# EAGLE board Promobot revA (EAGLE 6.5.0), part 1 of 3
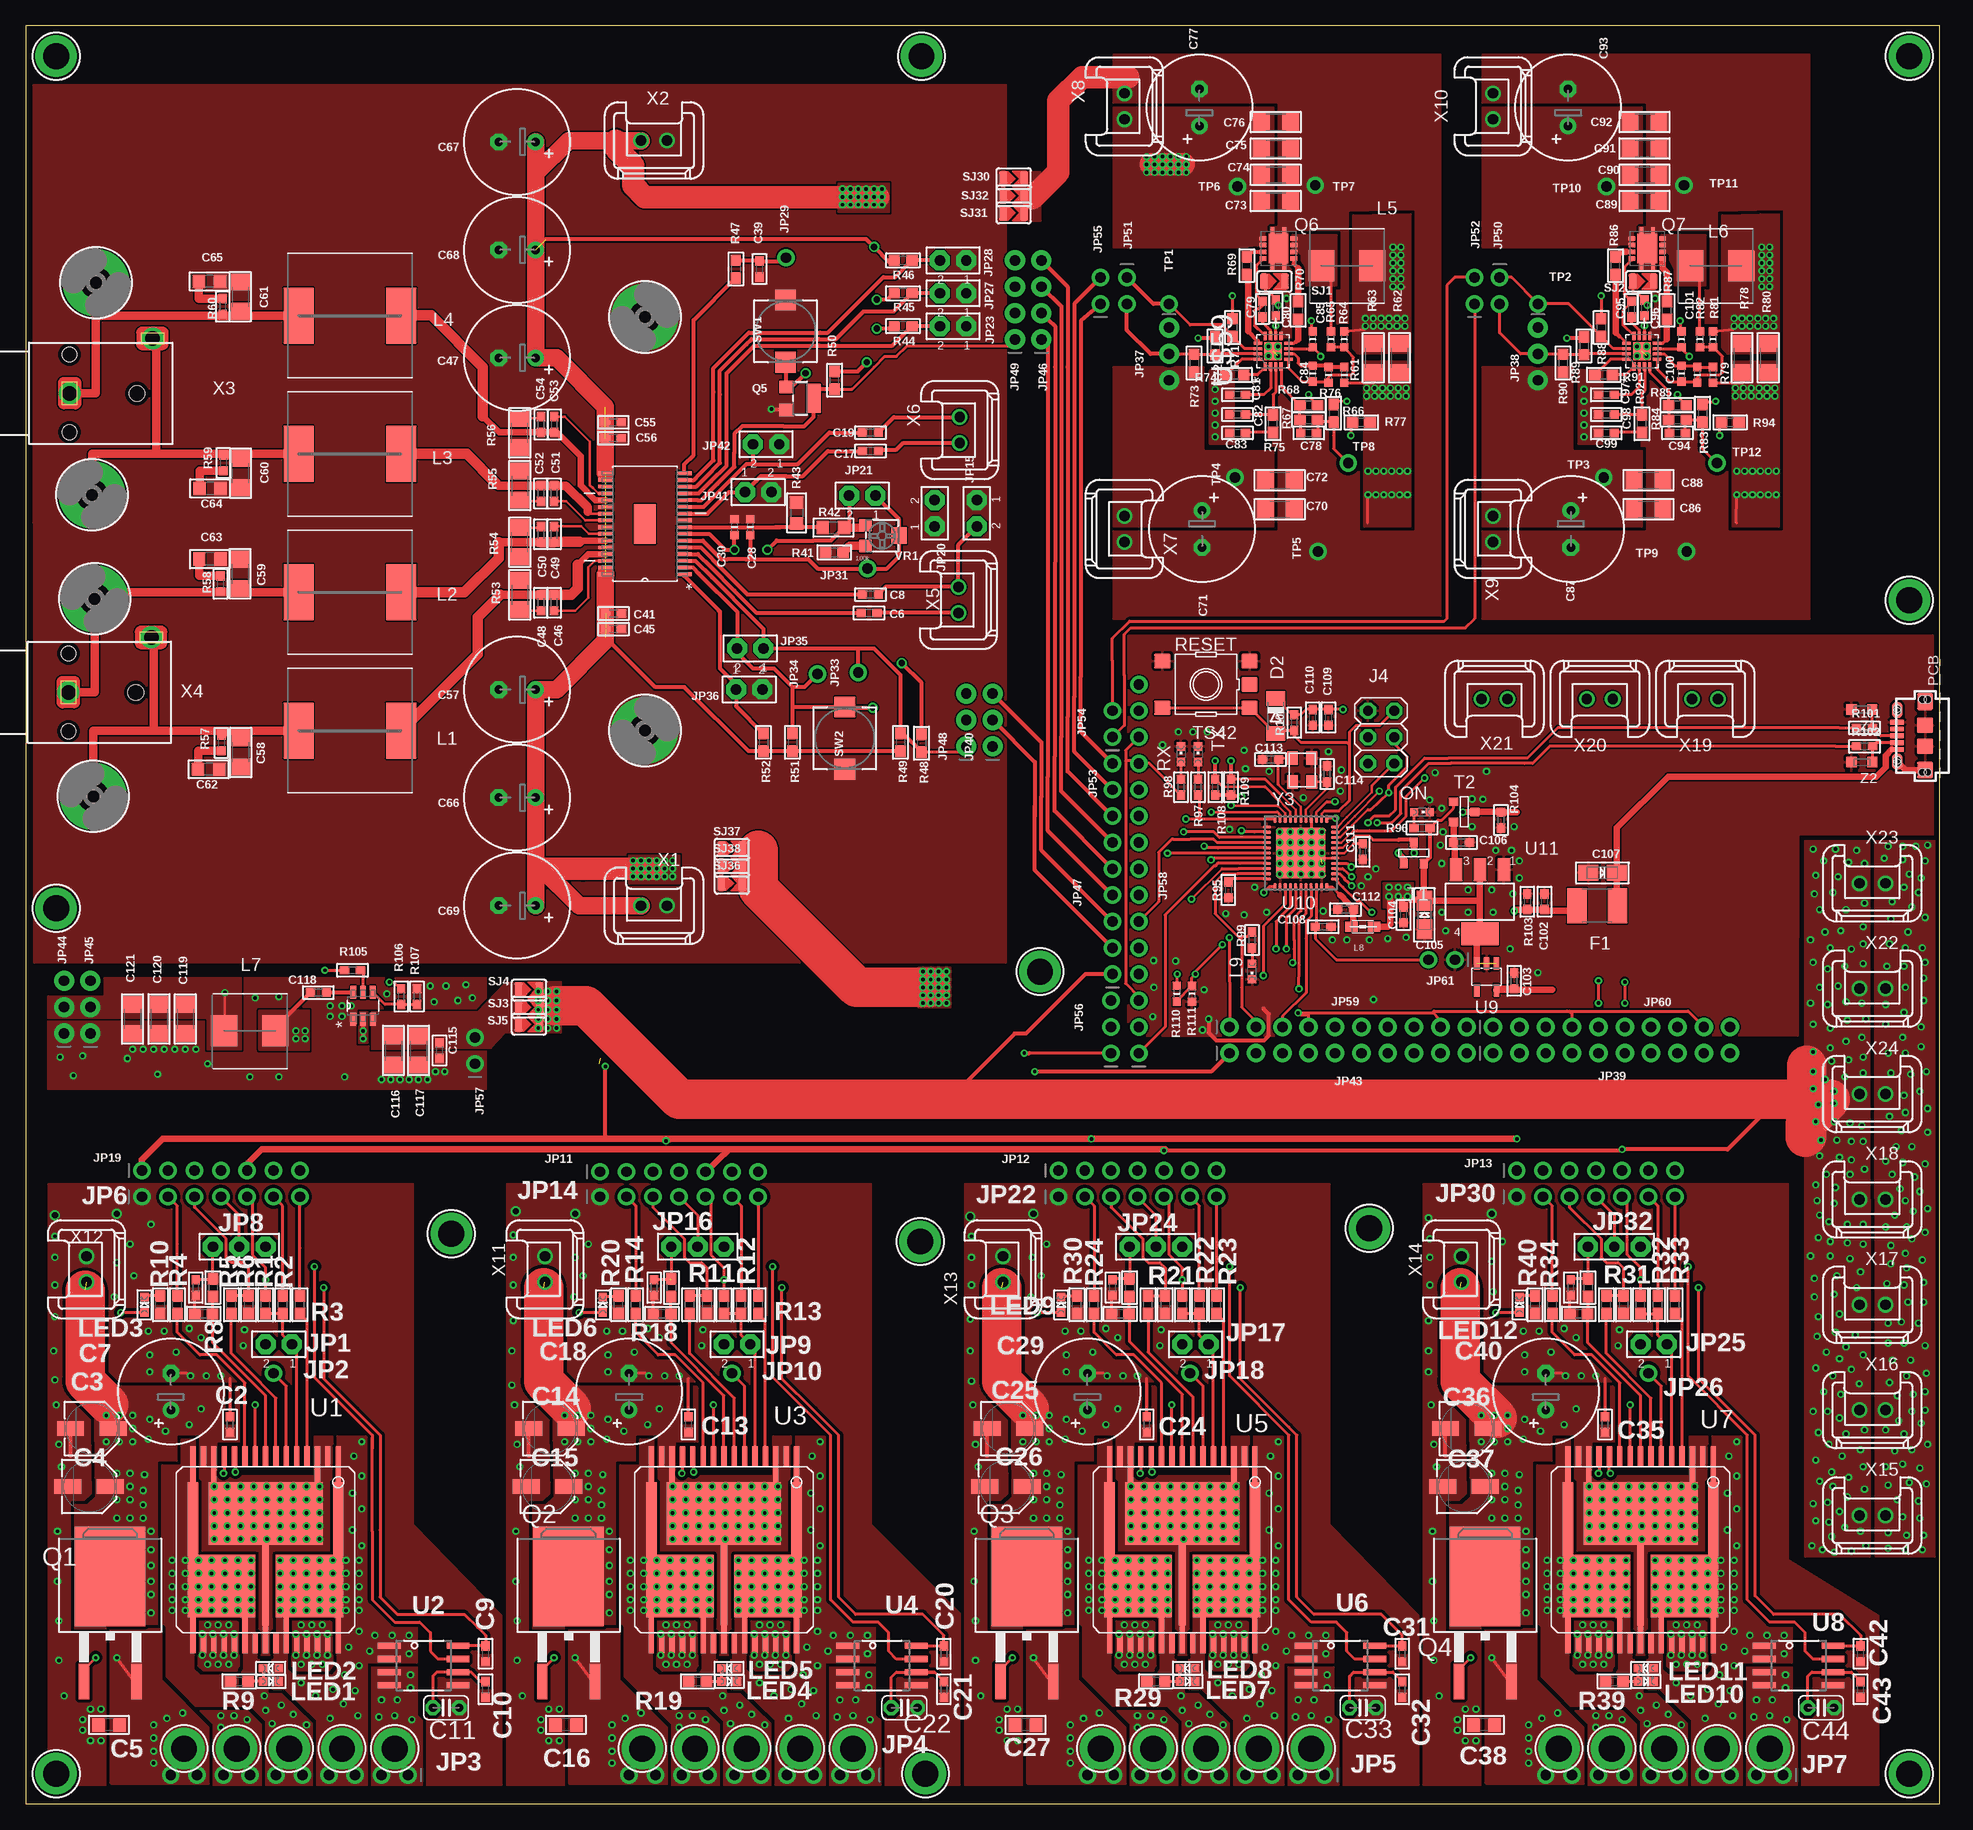
[diagram p10: board, top side]
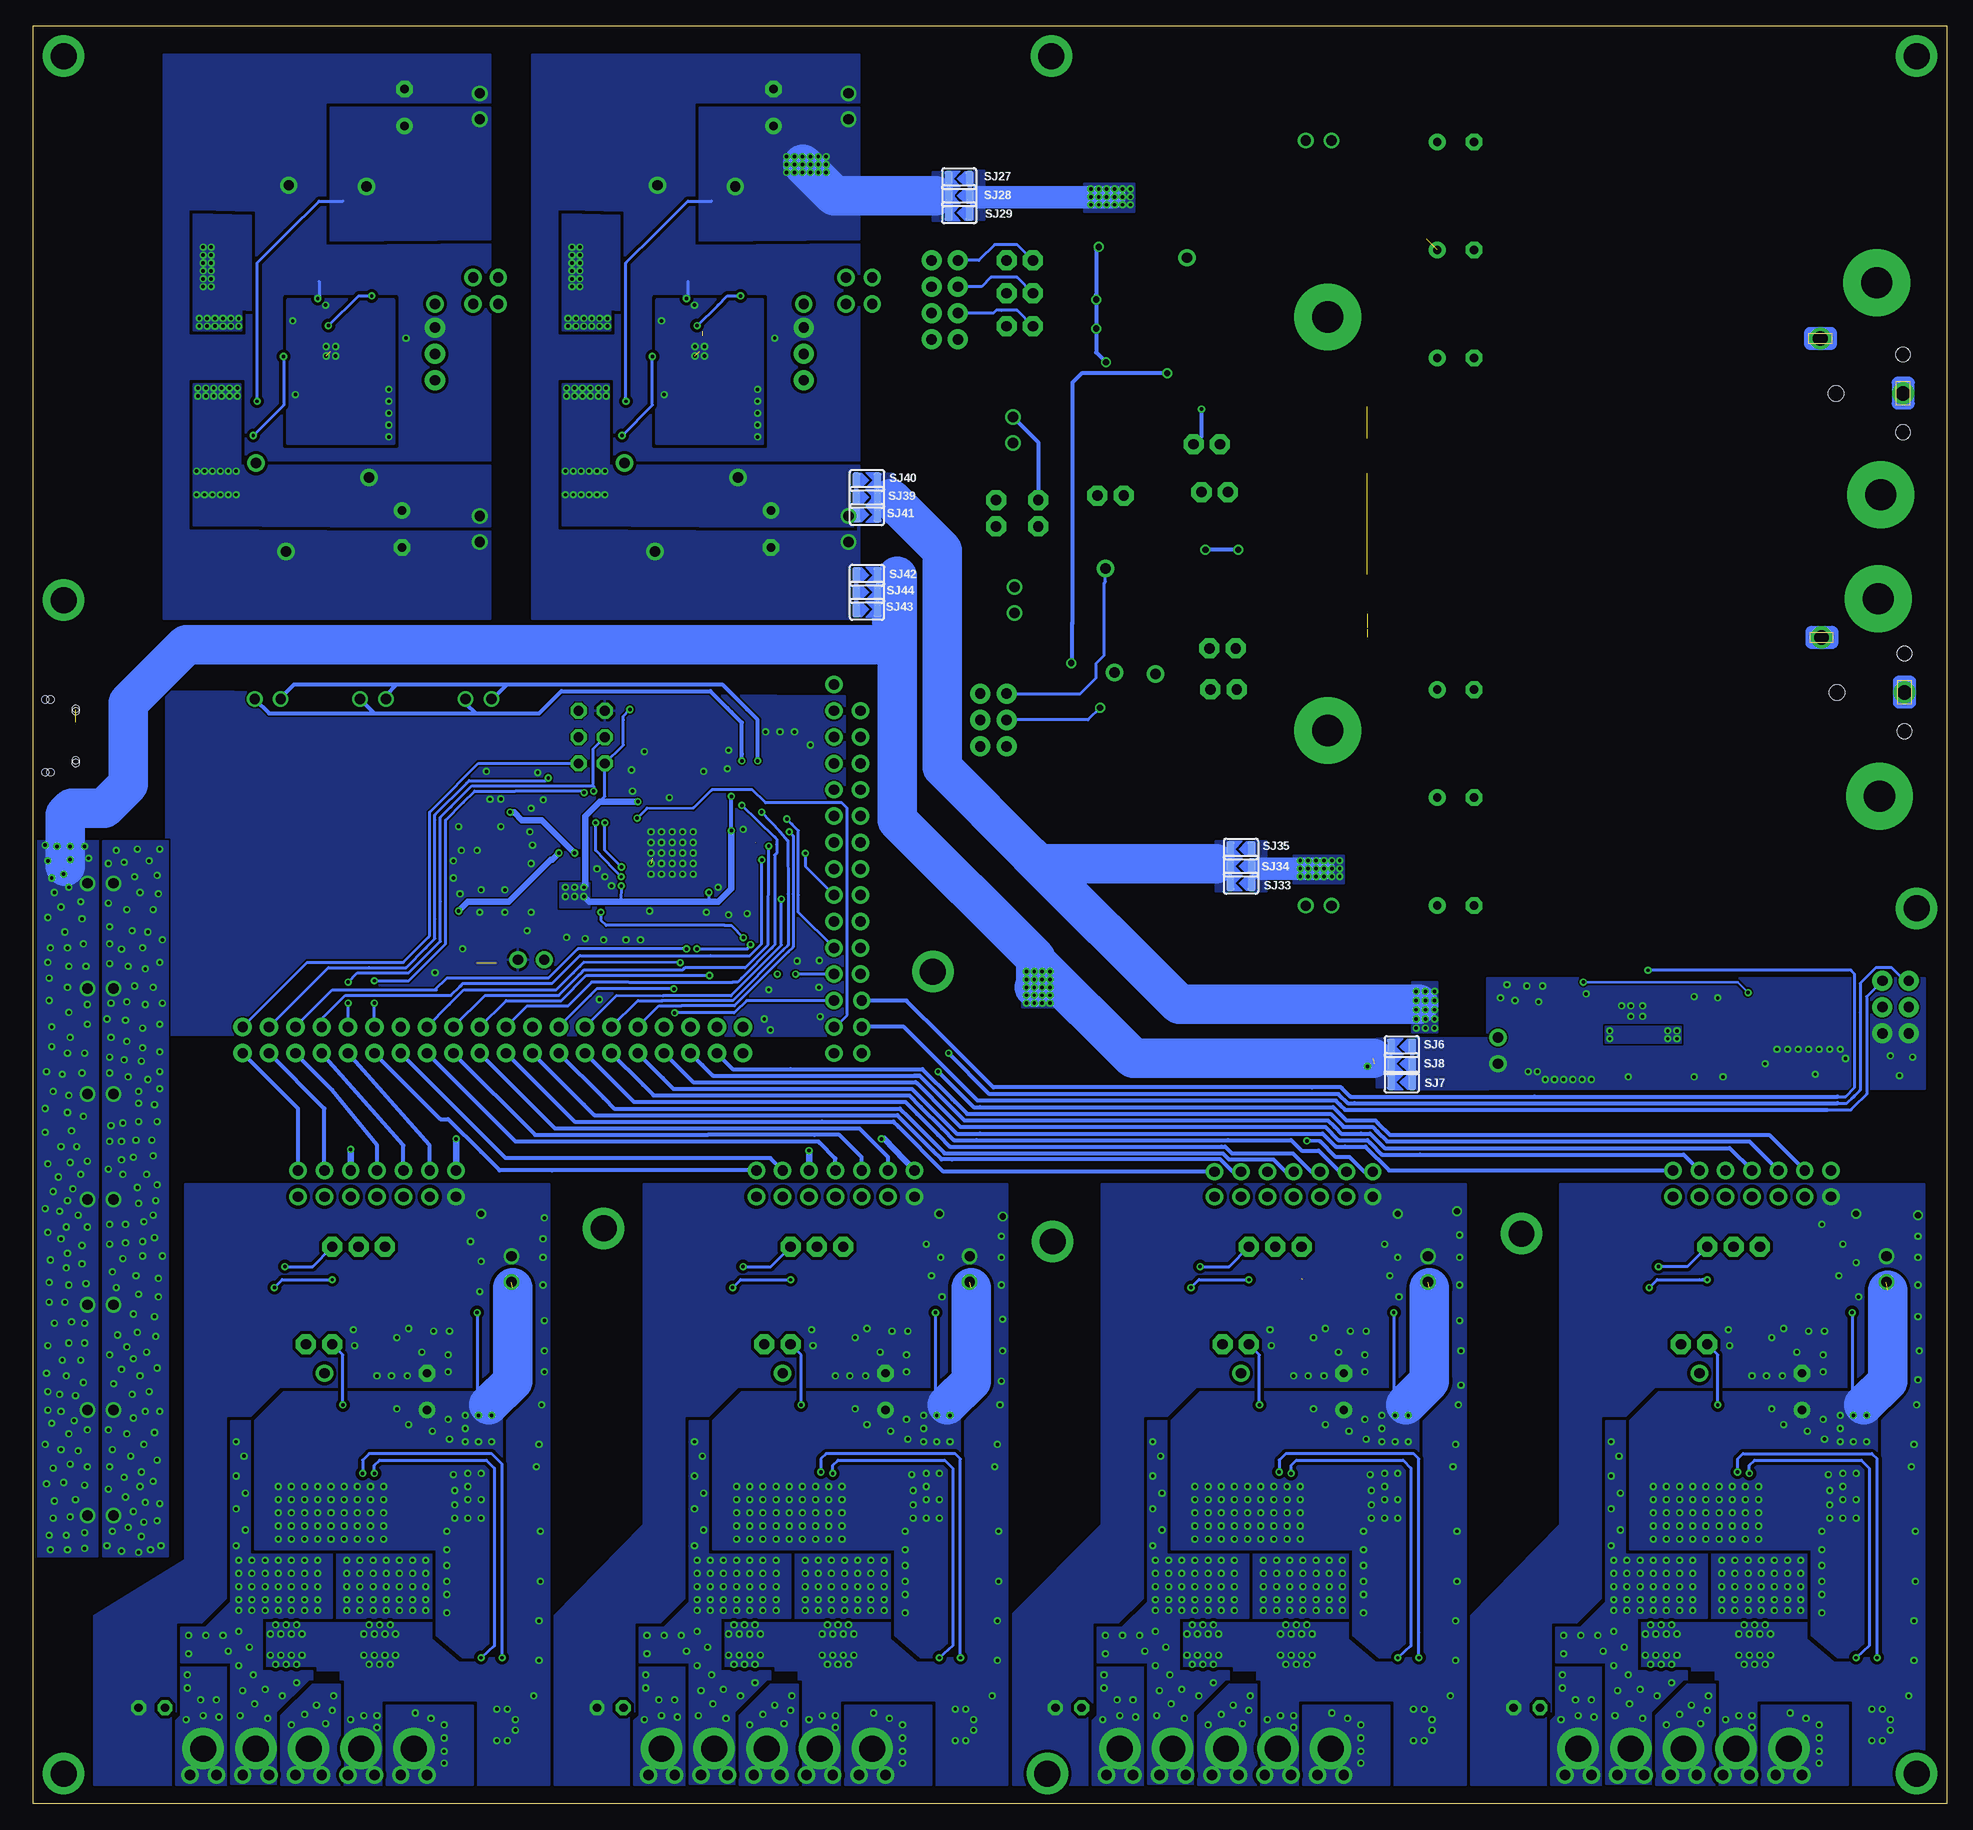
[diagram p11: board, bottom side, seen from below]

Size 184.53 x 171.45 mm. Coordinates in mm from the lower left corner, seen from the top.
Outline: 0,0 184.53,0 184.53,171.45 0,171.45 0,0
Copper layers (1*16): Top 0.0356mm / dielectric 1.5011mm / Bottom 0.0356mm
Design rules "oshpark-2layer": minimum track width 6mil, minimum drill 13mil, track to track 6mil, track to pad 6mil, pad to pad 6mil, via to via 6mil, smd to smd 6mil, copper to edge 15mil, drill to drill 6mil, minimum pad ring 7mil, minimum via ring 7mil, stop-mask expansion 4mil, vias tented up to drill 0mil, thermal gap 10mil
tKeepout: area 52.7,98.4 to 66.7,148.5

## Footprints (pad centres in the part's own frame; a part is rotated, then mirrored left to right if it is on the bottom)
_0603 = smd 0.9 x 0.8: 1 -0.762,0; 2 0.762,0
PANASONIC_C = smd 2.6 x 1.4: + 2.05,0; - -2.05,0
_0805 = smd 1.2 x 1.3: 1 -1.016,0; 2 1.016,0
CELEC_3.5MM_10MM = drill 0.813 pad 1.6: + -1.778,0 | drill 0.813 pad 1.6 octagon: - 1.778,0
C025-024X044 = drill 0.813 pad 1.422 octagon: 1 -1.27,0; 2 1.27,0
_0603MP = smd 0.8 x 0.8: 1 -0.762,0; 2 0.762,0
1206 = smd 1.6 x 1.8: 1 -1.4,0; 2 1.4,0
EIA3216-18/A-R = smd 1.95 x 1.5: + 1.375,0; - -1.375,0
MINIMELF = smd 1.4 x 1.8: A 1.7,0; C -1.7,0
L1812 = smd 1.9 x 3.4: 1 -1.95,0; 2 1.95,0
CON2_USB_MICRO_B_AT = smd 0.406 x 1.346: P1 -1.321,2.692; P2 -0.66,2.692; P3 0,2.692; P4 0.66,2.692; P5 1.321,2.692 | smd 1.651 x 1.549: S1 -3.302,0; S2 3.302,0 | smd 1.524 x 1.016: S3 -2.489,2.692; S4 2.489,2.692 | smd 1.524 x 1.524: S5 -1.016,0; S6 1.016,0 | hole 0.7: -3.505,0.254; -3.505,-0.254; 3.505,0.254; 3.505,-0.254; -2.616,2.692; -2.362,2.692; 2.362,2.692; 2.616,2.692
2X03 = drill 0.95 pad 1.55 octagon: 1 -2.54,-1.27; 2 -2.54,1.27; 3 0,-1.27; 4 0,1.27; 5 2.54,-1.27; 6 2.54,1.27
JUMPER2 = drill 1 pad 1.93 octagon: 1 2.54,0; 2 0,0
1X01_ROUND = drill 1 pad 1.676: 1 0,0
1X10_ROUND = drill 1 pad 1.676: 1 -11.43,0; 2 -8.89,0; 3 -6.35,0; 4 -3.81,0; 5 -1.27,0; 6 1.27,0; 7 3.81,0; 8 6.35,0; 9 8.89,0; 10 11.43,0
1X07_ROUND = drill 1 pad 1.676: 1 -7.62,0; 2 -5.08,0; 3 -2.54,0; 4 0,0; 5 2.54,0; 6 5.08,0; 7 7.62,0
JUMPER3 = drill 1 pad 1.93 octagon: 1 -2.54,0; 2 0,0; 3 2.54,0
1X03_ROUND_76 = drill 1 pad 1.93: 1 -2.54,0; 2 0,0; 3 2.54,0
1X10_ROUND70 = drill 1 pad 1.778: 1 -11.43,0; 2 -8.89,0; 3 -6.35,0; 4 -3.81,0; 5 -1.27,0; 6 1.27,0; 7 3.81,0; 8 6.35,0; 9 8.89,0; 10 11.43,0
1X04_ROUND_76 = drill 1 pad 1.93: 1 -3.81,0; 2 -1.27,0; 3 1.27,0; 4 3.81,0
1X02_ROUND = drill 1 pad 1.676: 1 -1.27,0; 2 1.27,0
1X03_ROUND = drill 1 pad 1.676: 1 -2.54,0; 2 0,0; 3 2.54,0
1X15_ROUND_70 = drill 1 pad 1.676: 1 -17.78,0; 2 -15.24,0; 3 -12.7,0; 4 -10.16,0; 5 -7.62,0; 6 -5.08,0; 7 -2.54,0; 8 0,0; 9 2.54,0; 10 5.08,0; 11 7.62,0; 12 10.16,0; 13 12.7,0; 14 15.24,0; 15 17.78,0
WE-PD_1260/1245/1280/1210 = smd 2.9 x 5.4: 1 -4.95,0; 2 4.95,0
WE-HCI_7030/7040/7050 = smd 2.5 x 3: 1 -2.45,0; 2 2.45,0
0805 = smd 1.2 x 1: 1 -1.1,0; 2 1.1,0
CHIPLED_0603 = smd 0.8 x 0.8: A 0,-0.75; C 0,0.75
MOUNTINGHOLE_2.5_PLATED_THICK = drill 2.5 pad 4: P$1 0,0
TO263 = smd 1 x 3.4: 1 -2.54,-6.6; 2 2.54,-6.6 | smd 6.8 x 9.6: 3 0,3.5
SOT23-W = smd 1.2 x 1.4: 1 -1.1,-1.3; 2 1.1,-1.3 | smd 2.8 x 1.4: 3 0,1.3
SON330X330 = smd 0.65 x 0.44: P$1 1.475,-0.975; P$2 1.475,-0.325; P$3 1.475,0.325; P$4 1.475,0.975; P$5 -1.475,0.975; P$6 -1.475,0.325; P$7 -1.475,-0.325; P$8 -1.475,-0.975 | smd 1.9 x 2.8: P$9 0,0 | smd 0.35 x 0.65: P$10 0.565,-1.725; P$11 -0.565,-1.725; P$12 0.565,1.725; P$13 -0.565,1.725
0603 = smd 1.1 x 1: 1 -0.85,0; 2 0.85,0
TS42 = smd 1.6 x 1.4: 1 -4.2,2.25; 2 4.2,2.25; 3 -4.2,-2.25; 4 4.2,-2.25; 5 -4.2,0
SOLDERJUMPER_ARROW_NOPASTE = smd 0.762 x 1.524: 1 -1.016,0; 2 1.016,0
PUSHBUTTON_SMD_SJ = smd 2 x 2: P$1 3,0; P$2 -3,0
SOT-23 = smd 0.787 x 0.889: 1 0.025,-1.016; 2 -0.94,1.016; 3 0.991,1.016
MULTIPOWERSO-30 = smd 0.508 x 12: 1 -7,-4; 15 7,-4; 16 7,4; 30 -7,4 | smd 0.508 x 2: 2 -6,-9; 4 -4,-9; 5 -3,-9; 6 -2,-9; 7 -1,-9; 8 0,-9; 9 1,-9; 10 2,-9; 11 3,-9; 12 4,-9; 14 6,-9; 17 6,9; 18 5,9; 19 4,9; 20 3,9; 22 1,9; 24 -1,9; 26 -3,9; 27 -4,9; 28 -5,9; 29 -6,9 | smd 0.508 x 4: 3 -5,-8; 13 5,-8; 21 2,8; 23 0,8; 25 -2,8 | smd 6.5 x 6: OUTA -4.25,3.5; OUTB 4.25,3.5 | smd 1 x 7.5: OUTA@1 -7,-2.755; OUTB@1 7,-2.755 | smd 11 x 6: VCC 0,-3.5 | smd 0.65 x 8.3: VCC@1 0,3.145
SOIC8_208MIL = smd 0.6 x 2.2: 1 -1.905,-3.315; 2 -0.635,-3.315; 3 0.635,-3.315; 4 1.905,-3.315; 5 1.905,3.315; 6 0.635,3.315; 7 -0.635,3.315; 8 -1.905,3.315
SOT23-DBV = smd 0.55 x 1.2: 1 -0.95,-1.3; 2 0,-1.3; 3 0.95,-1.3; 4 0.95,1.3; 5 -0.95,1.3
QFN44ML7X7 = smd 0.75 x 0.275: 1 -3.275,2.5; 2 -3.275,2; 3 -3.275,1.5; 4 -3.275,1; 5 -3.275,0.5; 6 -3.275,0; 7 -3.275,-0.5; 8 -3.275,-1; 9 -3.275,-1.5; 10 -3.275,-2; 11 -3.275,-2.5; 23 3.275,-2.5; 24 3.275,-2; 25 3.275,-1.5; 26 3.275,-1; 27 3.275,-0.5; 28 3.275,0; 29 3.275,0.5; 30 3.275,1; 31 3.275,1.5; 32 3.275,2; 33 3.275,2.5 | smd 0.275 x 0.75: 12 -2.5,-3.275; 13 -2,-3.275; 14 -1.5,-3.275; 15 -1,-3.275; 16 -0.5,-3.275; 17 0,-3.275; 18 0.5,-3.275; 19 1,-3.275; 20 1.5,-3.275; 21 2,-3.275; 22 2.5,-3.275; 34 2.5,3.275; 35 2,3.275; 36 1.5,3.275; 37 1,3.275; 38 0.5,3.275; 39 0,3.275; 40 -0.5,3.275; 41 -1,3.275; 42 -1.5,3.275; 43 -2,3.275; 44 -2.5,3.275 | smd 4.826 x 4.826: EXP 0,0
LINEAR_SOT223 = smd 1.219 x 2.235: 1 -2.311,-3.099; 2 0,-3.099; 3 2.311,-3.099 | smd 3.6 x 2.2: 4 0,3.099
SOT95P280X145-6N = smd 1.27 x 0.559: 1 -1.295,0.94; 2 -1.295,0; 3 -1.295,-0.94; 4 1.295,-0.94; 5 1.295,0; 6 1.295,0.94
SOP65P810X120-33N = smd 1.473 x 0.356: 1 -3.785,4.877; 2 -3.785,4.216; 3 -3.785,3.581; 4 -3.785,2.921; 5 -3.785,2.286; 6 -3.785,1.626; 7 -3.785,0.965; 8 -3.785,0.33; 9 -3.785,-0.33; 10 -3.785,-0.965; 11 -3.785,-1.626; 12 -3.785,-2.286; 13 -3.785,-2.921; 14 -3.785,-3.581; 15 -3.785,-4.216; 16 -3.785,-4.877; 17 3.785,-4.877; 18 3.785,-4.216; 19 3.785,-3.581; 20 3.785,-2.921; 21 3.785,-2.286; 22 3.785,-1.626; 23 3.785,-0.965; 24 3.785,-0.33; 25 3.785,0.33; 26 3.785,0.965; 27 3.785,1.626; 28 3.785,2.286; 29 3.785,2.921; 30 3.785,3.581; 31 3.785,4.216; 32 3.785,4.877 | smd 2.108 x 3.81: 33 0,0
QFN50P300X300X80-17N = smd 0.813 x 0.305: 1 -1.473,0.762; 2 -1.473,0.254; 3 -1.473,-0.254; 4 -1.473,-0.762; 9 1.473,-0.762; 10 1.473,-0.254; 11 1.473,0.254; 12 1.473,0.762 | smd 0.305 x 0.813: 5 -0.762,-1.473; 6 -0.254,-1.473; 7 0.254,-1.473; 8 0.762,-1.473; 13 0.762,1.473; 14 0.254,1.473; 15 -0.254,1.473; 16 -0.762,1.473 | smd 1.702 x 1.702: 17 0,0
MOUNTINGHOLE_3.0_PLATED = drill 3 pad 6.452: P$1 0,0
TRIMPOT_BOURNS3MM = smd 1.2 x 1.2: A -1,-1.6; S 1,-1.6 | smd 1.6 x 1.5: E 0,1.65
MKS1852-6-0-202 = drill 1 pad 1.422: 1 -1.25,0; 2 1.25,0
RC-5231 = drill 1.4 pad 1.778: S 0,0; T 5.3,-8 | hole 1.4: -3.75,0; 3.75,0 | hole 1.5: 0,-6.5
CRYSTAL-3.2-2.5 = smd 1.3 x 1.05: 1 -1.15,-0.925; 2 1.15,-0.925; 3 1.15,0.925; 4 -1.15,0.925
CT/CN0603 = smd 1 x 1: 1 -1,0; 2 1,0

## Placement (x,y rotation side)
C1  33n  [_0603]  16.38,49.78 270 top
C2  0.1u  [_0603]  19.68,36.58 90 top
C3  47u  [PANASONIC_C]  6.35,36.2 0 top
C4  47u  [PANASONIC_C]  6.1,30.61 0 top
C5  1u  [_0805]  8,7.62 180 top
C6  1u  [_0603]  81.31,114.83 180 top
C7  NP  [CELEC_3.5MM_10MM]  13.97,39.75 90 top
C8  1u  [_0603]  81.43,116.61 180 top
C9  0.1u  [_0603]  44.32,14.48 270 top
C10  1n  [_0603]  44.32,11.05 270 top
C11  NP  [C025-024X044]  40.51,9.27 0 top
C12  33n  [_0603]  60.58,49.78 270 top
C13  0.1u  [_0603]  63.88,36.58 90 top
C14  47u  [PANASONIC_C]  50.55,36.2 0 top
C15  47u  [PANASONIC_C]  50.29,30.61 0 top
C16  1u  [_0805]  52.07,7.62 180 top
C17  1u  [_0603]  81.43,130.45 180 top
C18  NP  [CELEC_3.5MM_10MM]  58.17,39.75 90 top
C19  1u  [_0603]  81.43,132.23 180 top
C20  0.1u  [_0603]  88.52,14.48 270 top
C21  1n  [_0603]  88.52,11.05 270 top
C22  NP  [C025-024X044]  84.71,9.27 0 top
C23  33n  [_0603]  104.78,49.78 270 top
C24  0.1u  [_0603]  108.08,36.58 90 top
C25  47u  [PANASONIC_C]  94.74,36.2 0 top
C26  47u  [PANASONIC_C]  94.49,30.61 0 top
C27  1u  [_0805]  96.39,7.62 180 top
C28  1u  [_0603MP]  69.85,123.11 270 top
C29  NP  [CELEC_3.5MM_10MM]  102.36,39.75 90 top
C30  1u  [_0603MP]  68.33,123.11 270 top
C31  0.1u  [_0603]  132.72,14.48 270 top
C32  1n  [_0603]  132.72,11.05 270 top
C33  NP  [C025-024X044]  128.91,9.27 0 top
C34  33n  [_0603]  148.97,49.78 270 top
C35  0.1u  [_0603]  152.27,36.58 90 top
C36  47u  [PANASONIC_C]  138.94,36.2 0 top
C37  47u  [PANASONIC_C]  138.68,30.61 0 top
C38  1u  [_0805]  140.59,7.62 180 top
C39  47p  [_0603]  70.74,148.01 90 top
C40  NP  [CELEC_3.5MM_10MM]  146.56,39.75 90 top
C41  1000p  [_0603]  56.67,114.78 180 top
C42  0.1u  [_0603]  176.91,14.48 270 top
C43  1n  [_0603]  176.91,11.05 270 top
C44  NP  [C025-024X044]  173.1,9.27 0 top
C45  0.1u  [_0603]  56.67,113.28 180 top
C46  0.22u  [_0603]  50.93,115.82 270 top
C47  220u  [CELEC_3.5MM_10MM]  47.37,139.45 180 top
C48  330p  [_0603]  49.66,115.82 90 top
C49  0.22u  [_0603]  50.93,122.43 90 top
C50  330p  [_0603]  49.66,122.43 270 top
C51  0.22u  [_0603]  50.93,126.36 270 top
C52  330p  [_0603]  49.66,126.36 90 top
C53  0.22u  [_0603]  50.95,133.02 90 top
C54  330p  [_0603]  49.68,133.02 270 top
C55  1000p  [_0603]  56.64,133.22 180 top
C56  0.1u  [_0603]  56.64,131.7 180 top
C57  220u  [CELEC_3.5MM_10MM]  47.37,107.44 180 top
C58  0.68u  [1206]  20.73,101.4 90 top
C59  0.68u  [1206]  20.65,118.62 270 top
C60  0.68u  [1206]  20.7,128.32 90 top
C61  0.68u  [1206]  20.68,145.34 270 top
C62  0.01u  [_0805]  17.63,99.77 180 top
C63  0.01u  [_0805]  17.73,120.04 180 top
C64  0.01u  [_0805]  17.75,126.85 180 top
C65  0.01u  [_0805]  17.7,146.81 180 top
C66  220u  [CELEC_3.5MM_10MM]  47.37,97.03 180 top
C67  220u  [CELEC_3.5MM_10MM]  47.37,160.27 180 top
C68  220u  [CELEC_3.5MM_10MM]  47.37,149.86 180 top
C69  220u  [CELEC_3.5MM_10MM]  47.37,86.61 180 top
C70  10u  [1206]  120.9,124.84 0 top
C71  np  [CELEC_3.5MM_10MM]  113.41,122.94 270 top
C72  10u  [1206]  120.9,127.64 0 top
C73  10u  [1206]  120.52,154.56 0 top
C74  10u  [1206]  120.52,157.1 0 top
C75  10u  [1206]  120.52,159.64 0 top
C76  10u  [1206]  120.52,162.18 0 top
C77  np  [CELEC_3.5MM_10MM]  113.16,163.58 90 top
C78  np  [_0603]  123.7,132.21 180 top
C79  0.1u  [_0603]  119.25,144.15 270 top
C80  4.7u  [_0603]  120.52,144.27 90 top
C81  0.1u  [_0603]  116.84,135.89 180 top
C82  150p  [_0603]  116.84,133.99 180 top
C83  0.015u  [_0603]  116.84,132.21 180 top
C84  100p  [_0603MP]  124.08,137.92 270 top
C85  0.1u  [_0603MP]  124.08,141.22 270 top
C86  10u  [1206]  156.46,124.84 0 top
C87  np  [CELEC_3.5MM_10MM]  148.97,122.94 270 top
C88  10u  [1206]  156.46,127.64 0 top
C89  10u  [1206]  156.08,154.56 0 top
C90  10u  [1206]  156.08,157.1 0 top
C91  10u  [1206]  156.08,159.64 0 top
C92  10u  [1206]  156.08,162.18 0 top
C93  np  [CELEC_3.5MM_10MM]  148.72,163.58 90 top
C94  np  [_0603]  159.26,132.21 180 top
C95  0.1u  [_0603]  154.81,144.15 270 top
C96  4.7u  [_0603]  156.08,144.27 90 top
C97  0.1u  [_0603]  152.4,135.89 180 top
C98  150p  [_0603]  152.4,133.99 180 top
C99  0.015u  [_0603]  152.4,132.21 180 top
C100  100p  [_0603MP]  159.64,137.92 270 top
C101  0.1u  [_0603MP]  159.64,141.22 270 top
C102  100n  [_0603]  146.43,87 90 top
C103  1u  [_0603]  143.51,79.38 90 top
C104  100n  [_0603]  132.84,85.72 270 top
C105  22u  [EIA3216-18/A-R]  134.87,85.72 90 top
C106  100n  [_0603]  138.43,92.71 0 top
C107  22u  [EIA3216-18/A-R]  152.02,89.79 0 top
C108  100n  [_0603]  125.09,84.58 0 top
C109  100n  [_0603]  125.6,104.78 270 top
C110  100n  [_0603]  124.08,104.78 270 top
C111  1u  [_0603]  128.91,91.82 270 top
C112  1u  [_0603]  127.25,86.23 180 top
C113  22P  [_0603]  120.02,100.71 0 top
C114  22p  [_0603]  125.48,99.31 270 top
C115  0.1u  [_0603]  39.88,72.64 270 top
C116  10u  [1206]  35.43,72.64 270 top
C117  10u  [1206]  37.85,72.64 270 top
C118  0.1u  [_0603]  28.19,78.23 0 top
C119  22u  [1206]  15.37,75.69 270 top
C120  22u  [1206]  12.83,75.69 270 top
C121  22u  [1206]  10.29,75.69 270 top
D2  CD1206-S01575  [MINIMELF]  120.52,104.9 270 top
F1  MF-MSMF050-2 500mA  [L1812]  151.51,86.61 180 top
J3  USB-MICRO!!!  [CON2_USB_MICRO_B_AT]  183.13,103 90 top
J4  3x2M  [2X03]  130.68,102.87 90 top
JP1  [JUMPER2]  23.11,44.32 0 top
JP2  [1X01_ROUND]  23.88,41.53 0 top
JP3  [1X10_ROUND]  25.4,2.79 180 top
JP4  [1X10_ROUND]  69.6,2.79 180 top
JP5  [1X10_ROUND]  113.79,2.79 180 top
JP6  [1X07_ROUND]  18.8,58.55 0 top
JP7  [1X10_ROUND]  157.99,2.79 180 top
JP8  [JUMPER3]  20.57,53.72 180 top
JP9  [JUMPER2]  67.31,44.32 0 top
JP10  [1X01_ROUND]  68.07,41.53 0 top
JP11  [1X07_ROUND]  62.99,60.96 0 top
JP12  [1X07_ROUND]  107.19,61.09 0 top
JP13  [1X07_ROUND]  151.38,61.09 0 top
JP14  [1X07_ROUND]  62.99,58.55 0 top
JP15  [JUMPER2]  91.69,123.19 90 top
JP16  [JUMPER3]  64.77,53.72 180 top
JP17  [JUMPER2]  111.51,44.32 0 top
JP18  [1X01_ROUND]  112.27,41.53 0 top
JP19  [1X07_ROUND]  18.8,61.09 0 top
JP20  [JUMPER2]  87.63,125.73 270 top
JP21  [JUMPER2]  79.38,126.16 0 top
JP22  [1X07_ROUND]  107.19,58.55 0 top
JP23  [JUMPER2]  88.14,142.49 0 top
JP24  [JUMPER3]  108.97,53.72 180 top
JP25  [JUMPER2]  155.7,44.32 0 top
JP26  [1X01_ROUND]  156.46,41.53 0 top
JP27  [JUMPER2]  88.14,145.67 0 top
JP28  [JUMPER2]  88.14,148.84 0 top
JP29  [1X01_ROUND]  73.28,149.1 90 top
JP30  [1X07_ROUND]  151.38,58.55 0 top
JP31  [1X01_ROUND]  81.15,119.13 90 top
JP32  [JUMPER3]  153.16,53.72 180 top
JP33  [1X01_ROUND]  80.26,109.09 90 top
JP34  [1X01_ROUND]  76.33,108.97 90 top
JP35  [JUMPER2]  68.58,111.43 0 top
JP36  [JUMPER2]  71.02,107.47 180 top
JP37  [1X03_ROUND_76]  110.24,139.83 270 top
JP38  [1X03_ROUND_76]  145.8,139.83 270 top
JP39  [1X10_ROUND70]  152.91,72.39 0 top
JP40  [1X03_ROUND_76]  93.22,104.52 90 top
JP41  [JUMPER2]  71.88,126.49 180 top
JP42  [JUMPER2]  70.1,131.11 0 top
JP43  [1X10_ROUND70]  127.51,72.39 0 top
JP44  [1X03_ROUND_76]  3.68,76.83 90 top
JP45  [1X03_ROUND_76]  6.22,76.83 90 top
JP46  [1X04_ROUND_76]  97.92,145.03 90 top
JP47  [1X07_ROUND]  104.78,87.63 90 top
JP48  [1X03_ROUND_76]  90.68,104.52 90 top
JP49  [1X04_ROUND_76]  95.38,145.03 90 top
JP50  [1X02_ROUND]  142.11,145.92 270 top
JP51  [1X02_ROUND]  106.17,145.92 270 top
JP52  [1X02_ROUND]  139.7,145.92 90 top
JP53  [1X02_ROUND]  104.78,99.06 270 top
JP54  [1X02_ROUND]  104.78,104.14 90 top
JP55  [1X02_ROUND]  103.63,145.92 90 top
JP56  [1X03_ROUND]  104.65,74.93 90 top
JP57  [1X02_ROUND]  43.31,72.64 90 top
JP58  [1X15_ROUND_70]  107.31,90.17 90 top
JP59  [1X10_ROUND70]  127.51,74.93 0 top
JP60  [1X10_ROUND70]  152.91,74.93 0 top
JP61  [1X02_ROUND]  136.53,81.41 180 top
L1  [WE-PD_1260/1245/1280/1210]  31.24,103.5 180 top
L2  [WE-PD_1260/1245/1280/1210]  31.24,116.84 180 top
L3  [WE-PD_1260/1245/1280/1210]  31.24,130.18 180 top
L4  [WE-PD_1260/1245/1280/1210]  31.24,143.51 180 top
L5  [WE-HCI_7030/7040/7050]  127.38,148.34 180 top
L6  [WE-HCI_7030/7040/7050]  162.94,148.34 180 top
L7  [WE-HCI_7030/7040/7050]  21.59,74.55 180 top
L8  MH2029-300Y  [0805]  128.91,84.58 180 top
L9  green  [CHIPLED_0603]  118.24,80.26 180 top
LED1  red  [CHIPLED_0603]  23.62,11.81 270 top
LED2  green  [CHIPLED_0603]  23.62,13.08 90 top
LED3  blue  [CHIPLED_0603]  11.43,48.13 0 top
LED4  red  [CHIPLED_0603]  67.82,11.81 270 top
LED5  green  [CHIPLED_0603]  67.82,13.08 90 top
LED6  blue  [CHIPLED_0603]  55.63,48.13 0 top
LED7  red  [CHIPLED_0603]  112.01,11.81 270 top
LED8  green  [CHIPLED_0603]  112.01,13.08 90 top
LED9  blue  [CHIPLED_0603]  99.82,48.13 0 top
LED10  red  [CHIPLED_0603]  156.21,11.81 270 top
LED11  green  [CHIPLED_0603]  156.21,13.08 90 top
LED12  blue  [CHIPLED_0603]  144.02,48.13 0 top
M1OUTA  MOUNTINGHOLE2.5_THICK  [MOUNTINGHOLE_2.5_PLATED_THICK]  35.56,5.33 0 top
M1OUTA1  MOUNTINGHOLE2.5_THICK  [MOUNTINGHOLE_2.5_PLATED_THICK]  30.48,5.33 0 top
M1OUTA2  MOUNTINGHOLE2.5_THICK  [MOUNTINGHOLE_2.5_PLATED_THICK]  79.76,5.33 0 top
M1OUTA3  MOUNTINGHOLE2.5_THICK  [MOUNTINGHOLE_2.5_PLATED_THICK]  20.32,5.33 0 top
M1OUTA4  MOUNTINGHOLE2.5_THICK  [MOUNTINGHOLE_2.5_PLATED_THICK]  15.24,5.33 0 top
M1OUTA5  MOUNTINGHOLE2.5_THICK  [MOUNTINGHOLE_2.5_PLATED_THICK]  74.68,5.33 0 top
M1OUTA6  MOUNTINGHOLE2.5_THICK  [MOUNTINGHOLE_2.5_PLATED_THICK]  64.52,5.33 0 top
M1OUTA7  MOUNTINGHOLE2.5_THICK  [MOUNTINGHOLE_2.5_PLATED_THICK]  59.44,5.33 0 top
M1OUTA8  MOUNTINGHOLE2.5_THICK  [MOUNTINGHOLE_2.5_PLATED_THICK]  123.95,5.33 0 top
M1OUTA9  MOUNTINGHOLE2.5_THICK  [MOUNTINGHOLE_2.5_PLATED_THICK]  118.87,5.33 0 top
M1OUTA10  MOUNTINGHOLE2.5_THICK  [MOUNTINGHOLE_2.5_PLATED_THICK]  108.71,5.33 0 top
M1OUTA11  MOUNTINGHOLE2.5_THICK  [MOUNTINGHOLE_2.5_PLATED_THICK]  103.63,5.33 0 top
M1OUTA12  MOUNTINGHOLE2.5_THICK  [MOUNTINGHOLE_2.5_PLATED_THICK]  168.15,5.33 0 top
M1OUTA13  MOUNTINGHOLE2.5_THICK  [MOUNTINGHOLE_2.5_PLATED_THICK]  163.07,5.33 0 top
M1OUTA14  MOUNTINGHOLE2.5_THICK  [MOUNTINGHOLE_2.5_PLATED_THICK]  152.91,5.33 0 top
M1OUTA15  MOUNTINGHOLE2.5_THICK  [MOUNTINGHOLE_2.5_PLATED_THICK]  147.83,5.33 0 top
M1OUTA16  MOUNTINGHOLE2.5_THICK  [MOUNTINGHOLE_2.5_PLATED_THICK]  2.92,2.92 0 top
M1OUTA17  MOUNTINGHOLE2.5_THICK  [MOUNTINGHOLE_2.5_PLATED_THICK]  181.61,2.92 0 top
M1OUTA18  MOUNTINGHOLE2.5_THICK  [MOUNTINGHOLE_2.5_PLATED_THICK]  181.61,168.53 0 top
M1OUTA19  MOUNTINGHOLE2.5_THICK  [MOUNTINGHOLE_2.5_PLATED_THICK]  86.74,2.92 0 top
M1OUTA20  MOUNTINGHOLE2.5_THICK  [MOUNTINGHOLE_2.5_PLATED_THICK]  86.36,168.53 0 top
M1OUTA21  MOUNTINGHOLE2.5_THICK  [MOUNTINGHOLE_2.5_PLATED_THICK]  2.92,86.36 0 top
M1OUTA22  MOUNTINGHOLE2.5_THICK  [MOUNTINGHOLE_2.5_PLATED_THICK]  41.02,54.99 0 top
M1OUTA23  MOUNTINGHOLE2.5_THICK  [MOUNTINGHOLE_2.5_PLATED_THICK]  86.23,54.23 0 top
M1OUTA24  MOUNTINGHOLE2.5_THICK  [MOUNTINGHOLE_2.5_PLATED_THICK]  129.54,55.5 0 top
M1OUTA25  MOUNTINGHOLE2.5_THICK  [MOUNTINGHOLE_2.5_PLATED_THICK]  97.79,80.26 0 top
M1OUTB  MOUNTINGHOLE2.5_THICK  [MOUNTINGHOLE_2.5_PLATED_THICK]  25.4,5.33 0 top
M1OUTB1  MOUNTINGHOLE2.5_THICK  [MOUNTINGHOLE_2.5_PLATED_THICK]  69.52,5.33 0 top
M1OUTB2  MOUNTINGHOLE2.5_THICK  [MOUNTINGHOLE_2.5_PLATED_THICK]  113.79,5.33 0 top
M1OUTB3  MOUNTINGHOLE2.5_THICK  [MOUNTINGHOLE_2.5_PLATED_THICK]  157.99,5.33 0 top
M1OUTB4  MOUNTINGHOLE2.5_THICK  [MOUNTINGHOLE_2.5_PLATED_THICK]  2.92,168.53 0 top
M1OUTB5  MOUNTINGHOLE2.5_THICK  [MOUNTINGHOLE_2.5_PLATED_THICK]  181.61,116.08 0 top
ON  blue  [CHIPLED_0603]  134.62,95.63 270 top
Q1  IPB80N03S4L-03  [TO263]  8.13,18.41 0 top
Q2  IPB80N03S4L-03  [TO263]  52.32,18.41 0 top
Q3  IPB80N03S4L-03  [TO263]  96.52,18.41 0 top
Q4  IPB80N03S4L-03  [TO263]  140.72,18.41 0 top
Q5  [SOT23-W]  74.65,135.53 270 top
Q6  CSD86330Q3D  [SON330X330]  120.78,149.99 180 top
Q7  CSD86330Q3D  [SON330X330]  156.34,149.99 180 top
R1  4.7k  [0603]  23.11,48.13 90 top
R2  1k  [0603]  24.77,48.13 90 top
R3  1k  [0603]  26.42,48.13 90 top
R4  1k  [0603]  14.61,48.13 90 top
R5  1k  [0603]  19.81,48.13 90 top
R6  10k  [0603]  21.46,48.13 270 top
R7  10k  [0603]  18.03,49.78 270 top
R8  1k  [0603]  17.14,47.24 180 top
R9  4.7k  [0603]  20.57,11.81 0 top
R10  4.7k  [0603]  12.95,48.13 90 top
R11  4.7k  [0603]  67.31,48.13 90 top
R12  1k  [0603]  68.96,48.13 90 top
R13  1k  [0603]  70.61,48.13 90 top
R14  1k  [0603]  58.8,48.13 90 top
R15  1k  [0603]  64.01,48.13 90 top
R16  10k  [0603]  65.66,48.13 270 top
R17  10k  [0603]  62.23,49.78 270 top
R18  1k  [0603]  61.34,47.24 180 top
R19  4.7k  [0603]  64.77,11.81 0 top
R20  4.7k  [0603]  57.15,48.13 90 top
R21  4.7k  [0603]  111.51,48.13 90 top
R22  1k  [0603]  113.16,48.13 90 top
R23  1k  [0603]  114.81,48.13 90 top
R24  1k  [0603]  103,48.13 90 top
R25  1k  [0603]  108.2,48.13 90 top
R26  10k  [0603]  109.86,48.13 270 top
R27  10k  [0603]  106.43,49.78 270 top
R28  1k  [0603]  105.54,47.24 180 top
R29  4.7k  [0603]  108.97,11.81 0 top
R30  4.7k  [0603]  101.35,48.13 90 top
R31  4.7k  [0603]  155.7,48.13 90 top
R32  1k  [0603]  157.35,48.13 90 top
R33  1k  [0603]  159,48.13 90 top
R34  1k  [0603]  147.19,48.13 90 top
R35  1k  [0603]  152.4,48.13 90 top
R36  10k  [0603]  154.05,48.13 270 top
R37  10k  [0603]  150.62,49.78 270 top
R38  1k  [0603]  149.73,47.24 180 top
R39  4.7k  [0603]  153.16,11.81 0 top
R40  4.7k  [0603]  145.54,48.13 90 top
R41  20k  [0603]  77.95,120.68 0 top
R42  100k  [_0805]  77.85,123.06 0 top
R43  20k  [_0805]  74.32,124.49 270 top
R44  100k  [0603]  84.58,142.49 180 top
R45  100k  [0603]  84.58,145.67 180 top
R46  100k  [0603]  84.58,148.84 180 top
R47  4.7k  [0603]  68.45,148.01 270 top
R48  100k  [0603]  86.36,102.29 270 top
R49  100k  [0603]  84.33,102.36 270 top
R50  100k  [0603]  77.98,137.29 90 top
R51  100k  [0603]  73.91,102.36 270 top
R52  100k  [0603]  71.12,102.36 270 top
R53  10  [1206]  47.62,116.59 270 top
R54  10  [1206]  47.62,121.67 90 top
R55  10  [1206]  47.62,127.13 270 top
R56  10  [1206]  47.62,132.21 90 top
R57  3.3  [_0603]  18.85,102.31 90 top
R58  3.3  [_0603]  18.77,117.65 270 top
R59  3.3  [_0603]  19.05,129.31 90 top
R60  3.3  [_0603]  18.97,144.4 270 top
R61  10  [_0603MP]  127.13,137.79 90 top
R62  20m  [1206]  132.46,139.45 270 top
R63  20m  [1206]  129.92,139.45 270 top
R64  10  [_0603MP]  127.13,141.22 270 top
R65  np  [_0603MP]  125.86,141.22 270 top
R66  62k  [0603]  126.11,134.11 270 top
R67  100k  [0603]  123.7,133.48 180 top
R68  10k  [0603]  123.7,134.87 0 top
R69  0  [0603]  117.73,148.34 90 top
R70  0  [0603]  122.68,144.02 90 top
R71  100k  [0603]  116.33,142.37 270 top
R72  59k  [0603]  114.68,140.59 270 top
R73  221k  [0603]  112.65,138.94 270 top
R74  76.8k  [0603]  116.59,137.79 180 top
R75  7.5k  [0603]  120.27,133.1 90 top
R76  np  [_0603MP]  125.6,137.79 90 top
R77  0  [0603]  128.78,133.22 180 top
R78  20m  [1206]  165.48,139.45 270 top
R79  10  [_0603MP]  162.69,137.79 90 top
R80  20m  [1206]  168.02,139.45 270 top
R81  10  [_0603MP]  162.69,141.22 270 top
R82  np  [_0603MP]  161.42,141.22 270 top
R83  24k  [0603]  161.67,134.11 270 top
R84  100k  [0603]  159.26,133.48 180 top
R85  11k  [0603]  159.26,134.87 0 top
R86  0  [0603]  153.29,148.34 90 top
R87  0  [0603]  158.24,144.02 90 top
R88  100k  [0603]  151.89,142.37 270 top
R89  59k  [0603]  150.24,140.59 270 top
R90  221k  [0603]  148.21,138.94 270 top
R91  76.8k  [0603]  152.15,137.79 180 top
R92  7.5k  [0603]  155.83,133.1 90 top
R93  np  [_0603MP]  161.16,137.79 90 top
R94  0  [0603]  164.34,133.22 180 top
R95  10k  [_0603]  115.95,88.14 270 top
R96  1k  [_0603]  134.62,94.11 180 top
R97  1k  [_0603]  113.03,98.04 90 top
R98  1k  [_0603]  111.38,98.04 90 top
R99  1k  [_0603]  118.24,83.31 270 top
R100  10k  [_0603]  122.3,104.27 90 top
R101  22  [_0603]  177.29,103.76 0 top
R102  22  [_0603]  177.29,101.98 0 top
R103  10k  [_0603]  144.78,87 270 top
R104  10k  [_0603]  142.24,94.87 90 top
R105  10k  [_0603]  31.5,80.39 180 top
R106  54.9k  [_0603]  36.2,77.85 270 top
R107  10k  [_0603]  37.72,77.85 90 top
R108  1k  [_0603]  114.68,98.04 270 top
R109  1k  [_0603]  116.2,98.04 270 top
R110  3k  [_0603MP]  110.98,78.12 90 top
R111  1k  [_0603MP]  112.44,78.11 270 top
RESET  TS42  [TS42]  113.79,107.95 180 top
RX  yellow  [CHIPLED_0603]  111.38,101.22 0 top
SJ1  [SOLDERJUMPER_ARROW_NOPASTE]  120.4,146.81 0 top
SJ2  [SOLDERJUMPER_ARROW_NOPASTE]  155.96,146.81 0 top
SJ3  [SOLDERJUMPER_ARROW_NOPASTE]  48.51,76.83 0 top
SJ4  [SOLDERJUMPER_ARROW_NOPASTE]  48.51,78.49 0 top
SJ5  [SOLDERJUMPER_ARROW_NOPASTE]  48.51,75.18 0 top
SJ6  [SOLDERJUMPER_ARROW_NOPASTE]  52.58,73.03 180 bottom
SJ7  [SOLDERJUMPER_ARROW_NOPASTE]  52.58,69.6 180 bottom
SJ8  [SOLDERJUMPER_ARROW_NOPASTE]  52.58,71.37 180 bottom
SJ27  [SOLDERJUMPER_ARROW_NOPASTE]  95.25,156.72 180 bottom
SJ28  [SOLDERJUMPER_ARROW_NOPASTE]  95.25,155.07 180 bottom
SJ29  [SOLDERJUMPER_ARROW_NOPASTE]  95.25,153.42 180 bottom
SJ30  [SOLDERJUMPER_ARROW_NOPASTE]  95.25,156.72 0 top
SJ31  [SOLDERJUMPER_ARROW_NOPASTE]  95.25,153.42 0 top
SJ32  [SOLDERJUMPER_ARROW_NOPASTE]  95.25,155.07 0 top
SJ33  [SOLDERJUMPER_ARROW_NOPASTE]  68.07,88.77 180 bottom
SJ34  [SOLDERJUMPER_ARROW_NOPASTE]  68.07,90.42 180 bottom
SJ35  [SOLDERJUMPER_ARROW_NOPASTE]  68.07,92.08 180 bottom
SJ36  [SOLDERJUMPER_ARROW_NOPASTE]  68.07,88.77 0 top
SJ37  [SOLDERJUMPER_ARROW_NOPASTE]  68.07,92.08 0 top
SJ38  [SOLDERJUMPER_ARROW_NOPASTE]  68.07,90.42 0 top
SJ39  [SOLDERJUMPER_ARROW_NOPASTE]  104.14,125.98 0 bottom
SJ40  [SOLDERJUMPER_ARROW_NOPASTE]  104.14,127.64 0 bottom
SJ41  [SOLDERJUMPER_ARROW_NOPASTE]  104.14,124.33 0 bottom
SJ42  [SOLDERJUMPER_ARROW_NOPASTE]  104.14,118.49 0 bottom
SJ43  [SOLDERJUMPER_ARROW_NOPASTE]  104.14,115.19 0 bottom
SJ44  [SOLDERJUMPER_ARROW_NOPASTE]  104.14,116.84 0 bottom
SW1  [PUSHBUTTON_SMD_SJ]  73.25,142.01 90 top
SW2  [PUSHBUTTON_SMD_SJ]  78.97,102.77 90 top
T1  FDN340P/PMV48XP  [SOT-23]  133.86,91.69 180 top
T2  PMV48XP  [SOT-23]  138.68,95.63 90 top
TP1  [1X01_ROUND]  110.24,144.65 90 top
TP2  [1X01_ROUND]  145.8,144.65 0 top
TP3  [1X01_ROUND]  152.15,127.89 0 top
TP4  [1X01_ROUND]  116.59,127.89 90 top
TP5  [1X01_ROUND]  124.59,120.78 90 top
TP6  [1X01_ROUND]  116.84,155.96 90 top
TP7  [1X01_ROUND]  124.33,156.08 90 top
TP8  [1X01_ROUND]  127.51,129.29 90 top
TP9  [1X01_ROUND]  160.15,120.78 0 top
TP10  [1X01_ROUND]  152.4,155.96 0 top
TP11  [1X01_ROUND]  159.89,156.08 0 top
TP12  [1X01_ROUND]  163.07,129.29 0 top
TX  yellow  [CHIPLED_0603]  113.03,101.22 0 top
U1  VNH5019A-E  [MULTIPOWERSO-30]  23.11,24.51 180 top
U2  ACS714  [SOIC8_208MIL]  38.35,13.34 270 top
U3  VNH5019A-E  [MULTIPOWERSO-30]  67.31,24.51 180 top
U4  ACS714  [SOIC8_208MIL]  82.55,13.34 270 top
U5  VNH5019A-E  [MULTIPOWERSO-30]  111.51,24.51 180 top
U6  ACS714  [SOIC8_208MIL]  126.75,13.34 270 top
U7  VNH5019A-E  [MULTIPOWERSO-30]  155.7,24.51 180 top
U8  ACS714  [SOIC8_208MIL]  170.94,13.34 270 top
U9  LP2985-33DBVR  [SOT23-DBV]  140.84,79.76 180 top
U10  ATMEGA32U4-XUMU  [QFN44ML7X7]  122.94,91.69 180 top
U11  NCP1117-5  [LINEAR_SOT223]  140.21,87 180 top
U12  TPS563200  [SOT95P280X145-6N]  32.51,76.96 90 top
U$6  TPA3116D2SOP65P810X120-33N  [SOP65P810X120-33N]  59.69,123.44 180 top
U$59  TPS43060QFN50P300X300X80-17N  [QFN50P300X300X80-17N]  120.27,140.08 90 top
U$68  TPS43060QFN50P300X300X80-17N  [QFN50P300X300X80-17N]  155.83,140.08 90 top
U$81  MOUNTINGHOLE  [MOUNTINGHOLE_3.0_PLATED]  6.5,97.16 90 top
U$82  MOUNTINGHOLE  [MOUNTINGHOLE_3.0_PLATED]  6.63,116.2 90 top
U$83  MOUNTINGHOLE  [MOUNTINGHOLE_3.0_PLATED]  6.38,126.24 90 top
U$84  MOUNTINGHOLE  [MOUNTINGHOLE_3.0_PLATED]  6.76,146.69 90 top
U$89  MOUNTINGHOLE  [MOUNTINGHOLE_3.0_PLATED]  59.69,103.5 0 top
U$90  MOUNTINGHOLE  [MOUNTINGHOLE_3.0_PLATED]  59.69,143.38 0 top
VR1  100k  [TRIMPOT_BOURNS3MM]  82.55,122.3 270 top
X1  MKS1852-6-0-202  [MKS1852-6-0-202]  60.58,86.61 180 top
X2  MKS1852-6-0-202  [MKS1852-6-0-202]  60.58,160.4 180 top
X3  RC-5231  [RC-5231]  4.22,136.02 90 top
X4  RC-5231  [RC-5231]  4.09,107.19 90 top
X5  MKS1852-6-0-202  [MKS1852-6-0-202]  89.92,116.1 270 top
X6  MKS1852-6-0-202  [MKS1852-6-0-202]  90.04,132.49 270 top
X7  MKS1852-6-0-202  [MKS1852-6-0-202]  105.92,122.94 90 top
X8  MKS1852-6-0-202  [MKS1852-6-0-202]  105.92,163.7 270 top
X9  MKS1852-6-0-202  [MKS1852-6-0-202]  141.48,122.94 90 top
X10  MKS1852-6-0-202  [MKS1852-6-0-202]  141.48,163.7 270 top
X11  MKS1852-6-0-202  [MKS1852-6-0-202]  50.04,51.56 270 top
X12  MKS1852-6-0-202  [MKS1852-6-0-202]  5.84,51.56 270 top
X13  MKS1852-6-0-202  [MKS1852-6-0-202]  94.23,51.56 270 top
X14  MKS1852-6-0-202  [MKS1852-6-0-202]  138.43,51.56 270 top
X15  MKS1852-6-0-202  [MKS1852-6-0-202]  178.05,27.81 180 top
X16  MKS1852-6-0-202  [MKS1852-6-0-202]  178.05,37.97 180 top
X17  MKS1852-6-0-202  [MKS1852-6-0-202]  178.05,48.13 180 top
X18  MKS1852-6-0-202  [MKS1852-6-0-202]  178.05,58.29 180 top
X19  MKS1852-6-0-202  [MKS1852-6-0-202]  161.93,106.55 0 top
X20  MKS1852-6-0-202  [MKS1852-6-0-202]  151.76,106.55 0 top
X21  MKS1852-6-0-202  [MKS1852-6-0-202]  141.6,106.55 0 top
X22  MKS1852-6-0-202  [MKS1852-6-0-202]  178.05,78.61 180 top
X23  MKS1852-6-0-202  [MKS1852-6-0-202]  178.05,88.77 180 top
X24  MKS1852-6-0-202  [MKS1852-6-0-202]  178.05,68.45 180 top
Y3  16MHz KX-7  [CRYSTAL-3.2-2.5]  123.06,99.69 90 top
Z1  CG0603MLC-05E  [CT/CN0603]  177.04,105.54 180 top
Z2  CG0603MLC-05E  [CT/CN0603]  177.04,100.46 180 top

## Tracks (layer width: path | path; a pad name or v marks a point on that pad's centre or on a via)
3V3
  Top 0.61: C103.1 141.95,78.61 U9.5 141.82,78.49 147.19,78.49
+5V  (via drill 0.33)  (1 unrouted)
  Top 0.254: U10.14 124.44,95.63
  Top 0.305: U10.24 119.63,93.73 118.49,93.73 117.47,93.73 v117.22,93.85 | U10.34 119.92,88.42 v119.38,87.88 | U10.2 126.71,89.69 127.13,89.28 127.13,89.15 v127.84,88.52 | 124.44,95.63 124.97,96.16 125.45,96.65 126.34,96.65 | R96.1 136.14,94.87 136.53,94.87 137.67,96.01 T2.3 | D2.C 122.1,105.03 R100.2 122.94,105.03 123.44,105.54 C110.1 C109.1 v127,105.54
  Top 0.406: R96.1 135.38,91.26 T1.2 | 126.34,96.65 v126.24,96.65 | v117.22,97.16 116.33,97.16 R109.2 R108.2
  Top 0.61: C105.+ 137,87.1 140.06,87.1 140.21,87.25 | C105.+ 134.85,87.12 | C104.1 132.72,86.74 132.72,87.12 | U11.2 140.21,87.25 | 140.21,87.25 U11.4 139.89,83.58 U9.3 | T1.2 134.8,87.18 | 134.8,87.18 C105.+ | L8.1 131.32,84.58 131.57,84.84 131.57,87.12 | 134.8,87.18 133.55,87.18 v133.22,87.5
  Bottom 0.305: v119.38,87.88 119.38,87.25 119.13,87 | v127.84,88.52 127.89,87 | 129.92,96.65 129.41,97.16 J4.2 127.64,102.11 127.64,104.52 127.64,104.9 v127,105.54
  Bottom 0.406: v117.22,93.85 v117.22,97.16
  Bottom 0.61: v117.22,93.85 117.22,88.27 118.49,87 119.13,87 127.89,87 130.94,87 v131.44,87.5 | v126.24,96.65 129.92,96.65 131.32,95.25 131.32,88.52 v131.44,88.39
  other vias: 133.22,88.39 132.33,88.39 132.33,87.5
  pour Top (rank 3, no thermals): 133.73,86.49 130.94,86.49 130.94,88.77 133.73,88.77
  pour Bottom: 130.94,86.49 133.73,86.49 133.73,88.77 130.94,88.77
+VIN
  Top 0.61: U11.3 137.79,90.19 137.79,92.58 C106.1 137.67,92.96 T2.2
A0  (via drill 0.33)
  Top 0.305: U10.36 121.44,86.77 119.89,85.22 119.35,84.68 119.35,79.9 v119.33,79.88
  Bottom 0.305: JP60.1 138.94,77.47 133.6,77.47 131.19,79.88 v119.33,79.88
A1  (via drill 0.33)
  Top 0.305: U10.37 121.94,86.53 121.16,85.72 121.03,85.6 120.55,85.09 v120.55,82.45 | v115.37,82.86 112.78,80.26 v112.78,80.01 112.44,79.67 R111.1 110.98,77.41 R110.1
  Bottom 0.305: v120.55,82.45 115.67,82.45 115.37,82.75 v115.37,82.86
A2  (via drill 0.33)
  Top 0.305: U10.38 122.44,86.37 121.72,85.62 121.54,85.42 v121.54,82.45
  Bottom 0.305: JP60.8 155.7,78.49 153.29,78.49 145.8,78.49 | 145.8,78.49 145.67,78.49 | v121.54,82.45 132.03,82.45 134.87,79.63 144.65,79.63 145.8,78.49
A3  (via drill 0.33)
  Top 0.305: U10.39 122.94,86.11 122.3,85.47 122.3,84.07 122.3,83.31 122.3,82.42 122.3,81.41 v122.15,81.13
  Bottom 0.305: JP60.3 144.4,77.09 143,78.49 137.54,78.49 134.11,78.49 132.46,80.14 | 132.46,80.14 132.08,80.52 131.83,80.77 | v122.15,81.13 131.44,81.15 132.46,80.14
A4  (via drill 0.33)
  Top 0.305: U10.40 123.44,85.84 122.81,85.22 122.81,80.9 v122.76,78.59
  Bottom 0.305: JP59.8 130.81,77.98 130.18,78.61 v122.76,78.59
A5
  Top 0.305: U10.41 123.94,85.58 123.57,85.22 123.44,85.09 123.44,83.44 123.44,78.23 121.16,75.95 JP59.3
AM0
  Top 0.406: JP28.2 R46.1 83.81,147.22 82.68,147.22 77.34,141.88 76.58,141.88 69.72,141.88 66.8,138.96 66.29,138.46 66.29,136.17 66.29,129.56 65.02,128.29 64.39,127.66 U$6.15
  Bottom 0.305: JP28.2 89.66,150.37 91.82,150.37 93.34,148.84 JP49.4
AM1
  Top 0.406: JP27.2 R45.1 83.68,143.92 80.77,143.92 78.11,141.25 76.45,141.25 69.98,141.25 69.47,140.74 66.93,138.2 66.93,135.91 66.93,130.71 66.93,129.31 65.53,127.91 64.64,127.03 U$6.14
  Bottom 0.305: JP27.2 89.66,147.19 92.2,147.19 93.09,146.3 JP49.3
AM2
  Top 0.406: JP23.2 R44.1 83.55,140.61 76.45,140.61 70.23,140.61 67.56,137.95 67.56,135.53 67.56,129.56 67.56,129.06 66.04,127.53 64.87,126.36 U$6.13
  Bottom 0.305: JP23.2 89.66,144.02 91.19,144.02 91.69,144.02 91.95,143.76 JP49.2
AMPGND  (via drill 0.33)
  Top 0.406: Q5.2 71.94,134.43 v71.88,134.49
  Bottom 0.406: v71.88,134.49 71.88,131.88 JP42.1
  pour Top (rank 6, no thermals): 0.74,165.74 0.79,81.15 94.49,81.15 94.49,165.74
AMPGVDD  (via drill 0.6)
  Top 0.406: C30.2 v68.33,120.93 67.44,120.93 65.89,122.48 U$6.7 | VR1.A 80.71,123.06 | v71.5,120.93 72.39,121.82 75.95,121.82 76.45,121.82 77.62,121.82 R42.2 79.38,123.57 JP21.2
  Top 0.813: 80.71,123.06 R42.2
  Bottom 0.406: v68.33,120.93 v71.5,120.93
AMPPVCC  (via drill 0.33, 0.6)  (9 unrouted)
  Top 0.254: C45.2 55.93,113.31 55.93,113.39 55.91,113.41 | U$6.17 55.88,128.35
  Top 0.406: 50.16,150.9 81.03,150.9 v81.79,150.14 83.25,148.68 83.57,148.68 R46.2 | R44.2 83.5,142.26 v82.04,142.26 | R45.2 83.71,145.69 83.07,145.06 v82.04,145.06 | R50.2 80.2,138.14 80.71,138.65 | 80.71,138.65 v81.09,139.03 80.71,138.65 | R49.2 R51.2 R52.2 69.68,101.51 63.5,107.7 60.71,107.7 55.88,112.52
  Top 1.676: U$6.32 55.88,118.54 55.88,112.52 55.88,112.14 51.18,107.44 C57.+ C66.+ 49.15,90.81 49.34,90.61 | 55.88,128.35 55.88,134.75 51.18,139.45 C47.+ C68.+ 49.15,157.23 | 49.15,157.23 C67.+ | 56.9,160.4 55.75,160.4 | 55.75,160.4 52.32,160.4 49.15,157.23 | 49.34,90.61 49.66,90.3 53.34,86.61 X1.2 | C69.+ 49.15,90.42 49.34,90.61 | X2.2 55.75,160.4
  Top 2.184: 78.99,154.94 82.17,154.94 59.69,154.94 58.55,156.08 58.55,157.99 56.9,159.64 56.9,160.4 | 59.56,90.17 60.71,90.17 53.72,90.17 49.78,90.17 49.66,90.3
  Bottom 0.406: v81.09,139.03 81.79,139.72 82.04,139.98 v82.04,142.26 v82.04,145.06 | v81.79,150.14 82.04,149.88 82.04,145.57 | 82.04,145.57 v82.04,145.06 | v82.04,145.06 82.04,145.57
  Bottom 2.184: 90.81,154.94 93.34,154.94 80.29,154.94 v80.26,154.97 | 63.63,90.17 66.17,90.17 60.1,90.17 v60.07,90.19
  other vias: 81.79,155.73 81.79,154.97 81.79,154.2 82.55,154.2 82.55,154.97 82.55,155.73 81.03,155.73 81.03,154.97 81.03,154.2 80.26,154.2 80.26,155.73 79.5,155.73 79.5,154.97 79.5,154.2 78.74,154.2 78.74,154.97 78.74,155.73 61.59,90.96 61.59,90.2 61.59,89.43 62.36,89.43 62.36,90.2 62.36,90.96 60.83,90.96 60.83,90.2 60.83,89.43 60.07,89.43 60.07,90.96 59.31,90.96 59.31,90.2 59.31,89.43 58.55,89.43 58.55,90.2 58.55,90.96
  pour Bottom (rank 3, no thermals): 92.84,152.78 92.84,157.48 94.49,157.48 94.49,152.78
  pour Top (rank 3): 78.36,156.21 83.19,156.21 83.19,153.54 78.36,153.54
  pour Top: 78.36,156.21 83.19,156.21 83.19,153.54 78.36,153.54
  pour Bottom: 83.19,156.21 78.36,156.21 78.36,153.54 83.19,153.54
  pour Bottom (rank 3, no thermals): 65.66,88.01 65.66,92.84 67.31,92.84 67.31,88.01
  pour Top: 58.17,91.44 62.99,91.44 62.99,88.77 58.17,88.77
  pour Top: 58.17,91.44 62.99,91.44 62.99,88.77 58.17,88.77
  pour Bottom: 62.99,91.44 58.17,91.44 58.17,88.77 62.99,88.77
AREF
  Top 0.305: U10.42 124.44,84.69 C108.1 124.33,83.44 126.36,81.41 JP61.2
AVCC
  Top 0.305: U10.44 125.96,88.42 126.75,87.63
  Top 0.61: 126.75,87.63 126.87,87.5 127.38,87 128.02,86.36 C112.1 128.02,84.79 L8.2
D0/RX  (via drill 0.33)
  Top 0.254: U10.20 121.44,95.5 120.73,96.27
  Top 0.305: v116.2,96.29 120.65,96.27 120.73,96.27
  Bottom 0.305: v116.2,96.29 113.03,93.22 112.85,93.04 112.85,92.51 112.85,91.69 113.06,91.52 113.06,82.83 113.31,82.55 116.23,79.63 116.61,79.25 117.09,79.25 127.13,79.25 130.68,79.25 132.97,76.96 136.91,76.96 JP59.10
D1/TX  (via drill 0.33)
  Top 0.254: 120.65,95.66 120.94,95.34 U10.21
  Top 0.305: U10.21 120.94,95.34 | v114.3,95.63 120.65,95.66
  Bottom 0.305: v114.3,95.63 112.52,93.73 111.76,92.89 111.73,87.76 111.73,82.8 112.24,82.3 117.07,77.47 123.95,77.47 | JP59.6 126.24,77.47 123.95,77.47 | 123.95,77.47 123.83,77.47
D2/SDA  (via drill 0.33)
  Top 0.254: U10.19 121.94,95.69 121.41,96.22 120.87,96.79
  Top 0.305: 120.87,96.79 120.78,96.8 119.51,98.07 115.57,98.04 115.44,98.04 R108.1 114.81,98.81
  Top 0.406: 114.81,98.81 114.68,98.93 v114.68,100.58
  Bottom 0.406: X19.1 160.68,106.66 159.38,107.95 149.48,107.95 | 149.48,107.95 138.81,107.95 | 138.81,107.95 118.11,107.95 115.7,105.54 114.68,104.52 v114.68,100.58 | X20.1 150.51,106.91 149.48,107.95 | X21.1 140.21,106.55 138.81,107.95
D3/SCL  (via drill 0.33)
  Top 0.254: U10.18 122.44,95.88 120.9,97.41
  Top 0.305: 120.9,97.41 119.51,98.81 R109.1
  Top 0.406: R109.1 v116.2,100.58
  Bottom 0.406: X19.2 163.18,106.53 161.8,105.16 151.64,105.16 | 151.64,105.16 141.86,105.16 | 141.86,105.16 135.76,105.16 133.6,107.31 119.25,107.31 117.6,105.66 | 117.6,105.66 117.22,105.28 | X21.2 142.85,106.15 141.86,105.16 | X20.2 153.01,106.53 151.64,105.16 | v116.2,100.58 116.2,101.22 116.2,104.27 117.6,105.66
D4*  (via drill 0.33)
  Top 0.305: U10.25 115.09,93.19 114.55,93.73 v111.63,93.73
  Bottom 0.305: JP59.5 124.21,76.96 122.05,76.96 116.92,76.96 111.71,82.17 111.25,82.63 111.25,82.68 111.25,87.76 111.25,93.34 v111.63,93.73
D5*  (via drill 0.33)
  Top 0.254: v112.39,87.25 115.34,90.19
  Top 0.305: U10.31 116.94,90.19 115.34,90.19
  Bottom 0.305: JP59.7 128.27,77.98 123.83,77.93 117.27,77.93 112.78,82.42 112.39,82.8 v112.39,87.25
D6*  (via drill 0.33)
  Top 0.305: U10.27 114.94,92.19 113.8,92.19 v113.61,92.35
  Bottom 0.305: JP60.2 140.97,77.98 135.38,77.98 133.86,77.98 131.95,79.88 131.76,80.07 131.44,80.39 122.45,80.39 121.92,80.39 121.69,80.62 115.9,80.62 113.84,82.68 113.67,82.86 v113.61,92.35
D7  (via drill 0.33)
  Top 0.305: U10.1 127,88.41 128.28,87.12 128.52,87.12 129.67,85.98 v129.79,85.98 | v116.05,83.54 JP59.1
  Bottom 0.305: v129.79,85.98 129.79,85.22 129.29,84.71 117.86,84.71 117.22,84.71 v116.05,83.54
D+
  Top 0.305: J3.P3 178.82,103 R101.2 178.05,105.52 Z1.1
D-
  Top 0.305: J3.P2 178.41,102.34 R102.2 178.05,100.47 Z2.1
FAULT
  Top 0.305: R48.2 90.13,101.44 JP48.1
  Top 0.406: U$6.3 64.57,119.86 66.17,118.26 70.23,114.2 71.12,113.31 JP35.1 80.39,111.43 | 80.39,111.43 81.76,111.43 84.33,108.86 R49.1 84.58,103.21 R48.2 | JP33.1 80.26,111.3 80.39,111.43
GAIN/SLV
  Top 0.406: U$6.8 72.26,123.11 | 72.26,123.11 72.75,123.11 | 74.3,123.11 76.78,123.11 R42.1 76.81,123.04 | 74.3,123.11 73.03,123.11 72.26,123.11 | R43.2 74.3,123.44 74.3,123.11
GND  (via drill 0.33)  (2 unrouted)
  Top 0.254: U10.5 124.85,91.19 | U10.15 123.95,94.95
  Top 0.305: 124.85,91.19 124.84,91.19 | 123.95,94.95 v123.95,93.73
  Top 0.406: v114.05,75.69 114.05,74.37 114.78,73.64 119.41,73.64 119.86,74.09 119.86,76.15 119.33,76.68
  Top 0.61: J3.S1 181.25,99.69 J3.S3
  other vias: 124.97,93.73 122.94,93.73 121.92,93.73 120.9,93.73 124.97,91.69 123.95,91.69 122.94,91.69 121.92,91.69 120.9,91.69 124.97,92.71 123.95,92.71 122.94,92.71 121.92,92.71 120.9,92.71 124.97,90.68 123.95,90.68 122.94,90.68 121.92,90.68 120.9,90.68 124.97,89.66 123.95,89.66 122.94,89.66 121.92,89.66 120.9,89.66 125.09,86.11 128.78,88.52 129.41,89.41 130.18,90.17 126.75,97.66 126.85,99.69 125.6,101.47 123.19,97.03 119.89,99.57 116.08,93.98 118.49,88.39 119.63,85.98 117.47,85.72 115.7,85.85 125.98,83.31 127.38,83.31 129.54,83.31 131.32,83.44 133.1,83.57 136.91,84.2 139.06,85.98 136.53,85.98 139.06,88.14 141.48,85.98 141.35,88.14 143.38,87.76 144.02,89.28 144.02,90.93 143.26,91.95 141.73,91.95 139.45,94.23 143.51,94.23 139.45,96.9 140.49,96.88 136.53,96.01 135.36,96.82 136.65,93.73 136.4,92.46 136.53,90.68 110.87,81.28 117.6,99.82 117.47,101.6 113.92,103.38 112.52,103.38 111.12,103.38 109.6,102.11 135.89,99.44 140.84,99.57 108.76,78.74 113.61,78.51 108.74,81.33 108.66,75.92 113.46,74.63 129.95,77.57 143.13,82.45 145.8,80.16
  pour Bottom (rank 6): 106.3,106.81 171.7,107.31 171.7,74.17 106.3,74.04
  pour Top (rank 6): 106.3,112.65 183.9,112.65 183.9,93.47 170.92,93.52 170.89,92.84 170.84,74.14 106.3,74.04
HWB
  Top 0.305: U10.33 116.12,89.19 R95.1
IO8  (via drill 0.33)
  Top 0.305: U10.28 117.35,91.69 114.94,91.69 114.05,91.69 v110.08,91.67
  Bottom 0.305: v110.08,91.67 110.08,90.42 JP58.7
IO9*  (via drill 0.33)
  Top 0.305: U10.29 117.21,91.19 114.94,91.19 114.44,91.19 v114.28,91.03
  Bottom 0.305: JP60.7 156.72,75.69 154.81,77.6 154.43,77.98 153.29,77.98 146.18,77.98 144.27,77.98 143.38,78.87 143.13,79.12 134.49,79.12 131.83,81.79 119.25,81.79 115.44,81.79 114.3,82.93 v114.28,91.03
IO10*
  Top 0.305: U10.30 117.08,90.69 114.95,90.69 114.72,90.44 114.55,90.42 109.86,85.72 109.86,74.93 JP58.1
IO11*  (via drill 0.33)
  Top 0.305: v126.3,95.06 125.53,95.06 U10.12
  Bottom 0.254: 120.9,96.01 125.35,96.01
  Bottom 0.305: JP58.2 107.19,74.93 106.05,76.07 106.05,95.76 106.05,96.01 106.55,96.52 113.92,96.52 115.21,97.81 119,97.81 119.1,97.79 120.9,96.01 | 125.35,96.01 v126.3,95.06
IO12*  (1 unrouted)
  Top 0.305: U10.26 114.88,92.69 | 114.86,92.69 114.53,93.02 112.27,93.02 110.64,93.02 110.49,93.02 109.22,91.75 109.22,87 JP58.6
IO13*
  Top 0.254: 116.81,89.69 115.47,89.69 114.68,88.9
  Top 0.305: U10.32 116.81,89.69 | 114.68,88.9 114.68,85.85 116.46,84.07 116.9,83.63 | 116.9,83.63 117.22,83.31 117.22,78.74 117.22,76.83 118.62,75.44 JP59.2 | R99.1 117.79,83.63 116.9,83.63
LEFT+
  Top 0.813: L3.2 18.87,130.18 | 18.87,130.18 16.74,130.18 12.57,130.18 | 12.57,130.18 6.38,130.18 U$83.P$1 | X3.T 12.55,141.32 12.57,141.29 12.57,130.18 | 18.87,130.18 18.87,130.07 R59.2 20.7,130.07 C60.2
LEFT-
  Top 0.813: L4.2 20.09,143.51 | 20.09,143.51 18.92,143.51 | 18.92,143.51 6.76,143.51 | 6.76,143.51 U$84.P$1 | 6.76,143.51 6.76,136.02 X3.S | R60.2 18.97,143.51 18.92,143.51 | C61.2 20.68,143.51 20.09,143.51
LIN+
  Top 0.406: C17.1 82.32,130.58 83.95,130.58 84.6,131.24 X6.2
LIN-
  Top 0.406: C19.1 83.7,133.74 X6.1
  Bottom 0.406: X6.1 87.63,131.32 JP20.2
M1CS
  Top 0.305: JP8.2 20.57,56.77 JP6.4
M1CS1
  Top 0.305: C1.1 17.95,50.55 R7.1 JP8.3
M1CS2  (via drill 0.33 pad 0.25)
  Top 0.305: U2.7 39.75,13.97 38.99,14.73 38.99,16.51 37.97,17.53 35.56,17.53 33.4,19.68 33.4,26.29 33.4,34.29 | 33.4,34.29 33.4,35.31 | 33.4,34.29 33.4,35.56 27.81,41.15 v27.81,51.82
  Bottom 0.305: JP8.1 25.02,51.82 v27.81,51.82
M1CS4
  Top 0.305: 62.23,50.63 62.14,50.55
M1CS6
  Top 0.305: 150.62,50.63 150.53,50.55
M1ENA/B
  Top 0.305: R2.2 24.77,52.7 24.77,57.66 JP6.6
M1GND  (via drill 0.33 pad 0.25, 0.6 pad 0.25)
  Top 0.305: R8.2 16.3,49.02 C1.2 | 15.49,41.53 C7.- | C2.2 19.68,41.02
  Top 0.406: 4.3,33.53 C3.-
  other vias: 17.53,13.46 18.54,13.46 19.56,13.46 17.02,14.35 18.03,14.35 19.05,14.35 20.07,14.35 17.53,17.27 18.54,17.27 19.56,17.27 26.54,13.46 27.56,13.46 28.57,13.46 26.04,14.35 27.05,14.35 28.07,14.35 29.08,14.35 26.54,17.27 27.56,17.27 28.57,17.27 7.24,9.14 6.22,9.14 5.46,8.13 5.46,7.11 7.24,6.1 6.22,6.1 18.8,8.51 17.02,16.38 18.03,16.38 19.05,16.38 20.07,16.38 26.04,16.38 27.05,16.38 28.07,16.38 29.08,16.38 18.8,7.37 20.07,8.51 21.34,8.13 15.75,45.85 16.89,44.96 21.08,45.72 20.95,44.2 13.34,45.59 11.81,45.59 3.68,10.41 3.17,13.84 3.17,17.65 3.05,21.46 3.05,26.29 3.43,32.51 3.17,34.67 2.92,38.48 2.79,40.89 2.79,46.99 2.67,43.69 2.79,50.04 10.41,50.93 8.51,48.9 18.8,41.27 17.4,41.27 15.88,41.27 14.48,43.56 11.94,43.31 11.94,41.66 8.76,52.2 10.03,53.98 12.06,55.88 8.76,56.9 2.79,56.77 2.79,54.74 2.79,52.7
  pour Top (isolate 0.305, no thermals): 16.64,13.34 17.14,12.83 20.19,12.83 20.57,13.34 20.57,17.4 20.07,17.78 16.89,17.78 16.64,17.53
  pour Top (isolate 0.305, no thermals): 25.65,13.34 26.16,12.83 29.21,12.83 29.59,13.34 29.59,17.4 29.08,17.78 25.91,17.78 25.65,17.53
  pour Bottom (isolate 0.305, rank 6, no thermals): 13.08,16.26 13.08,17.91 29.84,17.91 29.84,12.83 22.35,12.83 22.35,1.78 17.91,1.78 17.91,9.53 9.53,9.53 9.53,1.78 2.16,1.78 2.16,59.82 13.72,59.82 13.72,46.48 27.94,46.48 27.81,39.75 8.76,39.75 6.73,37.72 6.73,14.1 10.54,14.1
  pour Bottom (isolate 0.305, rank 6, no thermals): 38.23,1.78 45.9,1.78 45.9,18.16 37.34,26.92 37.34,59.82 13.72,59.82 13.72,46.48 27.94,46.48 27.94,39.62 30.61,36.96 32.89,36.96 32.89,19.56 35.43,17.02 37.72,17.02 37.72,8.51 38.23,8
  pour Top (isolate 0.305, rank 6, no thermals): 2.16,1.78 45.9,1.78 45.9,18.16 37.34,26.92 37.34,59.82 2.16,59.82
M1INA
  Top 0.305: R3.2 26.42,53.59 JP6.7
M1INB
  Top 0.305: R4.2 14.61,53.98 14.61,57.66 JP6.2
M1OUTA  (via drill 0.33 pad 0.25)
  other vias: 30.61,9.65 26.54,11.68 29.34,8.26 31.75,10.92 27.94,10.41 29.59,11.05 24.51,23.5 24.51,22.23 24.51,20.95 24.51,19.68 24.51,18.67 25.78,23.5 25.78,22.23 25.78,20.95 25.78,19.68 25.78,18.67 27.05,23.5 27.05,22.23 27.05,20.95 27.05,19.68 27.05,18.67 28.32,23.5 28.32,22.23 28.32,20.95 28.32,19.68 28.32,18.67 30.86,23.5 30.86,22.23 30.86,20.95 30.86,19.68 30.86,18.67 32.13,23.5 32.13,22.23 32.13,20.95 32.13,19.68 32.13,18.67 29.59,23.5 29.59,22.23 29.59,20.95 29.59,19.68 29.59,18.67 32.38,24.89 31.5,26.42 32.38,28.45 31.5,29.97 32.38,31.62 31.62,33.53 32.38,34.92 32.13,16.64 31.11,15.11 32.13,13.34 30.73,12.45 32,8.51 33.66,16.26 35.31,16.26 36.96,16.26 33.15,14.73 36.96,14.48
  pour Top (isolate 0.305, rank 2, no thermals): 29.59,35.43 32.89,35.43 32.89,1.78 28.07,1.78 28.07,8.13 25.02,11.05 23.75,11.05 23.75,24.38 29.59,24.38
  pour Bottom (isolate 0.305, rank 3, no thermals): 23.11,17.91 23.11,24.51 30.61,24.51 30.61,36.96 32.89,36.96 32.89,1.91 28.07,1.91 28.07,8.51 25.02,11.56 25.02,12.83 29.84,12.83 29.84,17.91
  pour Top (isolate 0.305, rank 3, no thermals): 32.89,13.59 32.89,19.56 35.43,17.02 37.72,17.02 37.72,13.59
  pour Bottom (isolate 0.305, rank 3, no thermals): 32.89,13.59 32.89,19.43 35.31,17.02 37.72,17.02 37.72,13.59
M1OUTA2  (via drill 0.33 pad 0.25)
  other vias: 34.29,10.03 35.81,10.03 34.04,8.38 35.56,8.51 37.21,8.13 37.08,12.45 37.08,11.18
  pour Top (isolate 0.305, rank 4, no thermals): 38.23,8 37.72,8.51 37.72,13.34 32.89,13.34 32.89,1.78 38.23,1.78
  pour Bottom (isolate 0.305, rank 4, no thermals): 32.89,13.34 37.72,13.34 37.72,8.51 38.23,8 38.23,1.78 32.89,1.78
M1OUTB  (via drill 0.33 pad 0.25)
  other vias: 22.99,10.41 24.64,9.53 25.78,8.64 27.05,7.62 23.75,7.75 23.11,9.02 21.72,23.5 21.72,22.23 21.72,20.95 21.72,19.68 21.72,18.67 15.37,23.5 15.37,22.23 15.37,20.95 15.37,19.68 15.37,18.67 16.64,23.5 16.64,22.23 16.64,20.95 16.64,19.68 16.64,18.67 17.91,23.5 17.91,22.23 17.91,20.95 17.91,19.68 17.91,18.67 19.18,23.5 19.18,22.23 19.18,20.95 19.18,19.68 19.18,18.67 20.45,23.5 20.45,22.23 20.45,20.95 20.45,19.68 20.45,18.67 14.1,23.5 14.1,22.23 14.1,20.95 14.1,19.68 14.1,18.67
  pour Top (isolate 0.305, rank 4, no thermals): 16.76,35.18 14.99,35.18 14.99,32.64 13.08,32.64 13.08,11.94 15.62,9.4 21.72,9.4 23.11,8 23.11,1.78 28.07,1.78 28.07,8.13 25.02,11.05 20.45,11.05 20.45,12.57 22.48,12.57 22.48,24.38 16.76,24.38
  pour Bottom (isolate 0.305, rank 4, no thermals): 23.11,24.51 13.08,24.51 13.08,17.91 23.11,17.91
  pour Bottom (isolate 0.305, no thermals): 28.07,1.78 28.07,8.51 25.02,11.56 22.35,11.56 22.35,1.78
M1PWM
  Top 0.305: R5.2 R6.1 21.46,51.69 20.95,52.2 19.81,52.2 19.3,52.7 19.3,54.48 16.26,57.53 JP6.3
M1VCC  (via drill 0.33 pad 0.25)  (1 unrouted)
  Top 0.305: LED3.A 9.16,47.38 v9.14,47.37
  Top 3.81: 5.71,49.53 5.71,40.77 8,38.48
  Bottom 0.305: v9.14,47.37 9.14,37.59 v9.02,37.47
  Bottom 3.81: 8,38.48 5.71,40.77 5.71,49.53
  other vias: 18.16,25.53 18.16,30.61 18.16,28.07 18.16,26.8 18.16,29.34 19.43,25.53 19.43,30.61 19.43,28.07 19.43,26.8 19.43,29.34 27.05,25.53 27.05,30.61 27.05,28.07 27.05,26.8 27.05,29.34 28.32,25.53 28.32,30.61 28.32,28.07 28.32,26.8 28.32,29.34 25.78,25.53 25.78,30.61 25.78,28.07 25.78,26.8 25.78,29.34 24.51,25.53 24.51,30.61 24.51,28.07 24.51,26.8 24.51,29.34 23.24,25.53 23.24,30.61 23.24,28.07 23.24,26.8 23.24,29.34 21.97,25.53 21.97,30.61 21.97,28.07 21.97,26.8 21.97,29.34 20.7,25.53 20.7,30.61 20.7,28.07 20.7,26.8 20.7,29.34 7.75,37.47 10.29,37.47 10.29,36.2 10.29,34.92 7.75,34.92 9.02,34.92 8.76,31.88 10.03,31.88 10.03,30.61 10.03,29.34 8.76,29.34 8.76,27.56 10.03,27.56 11.3,27.56 12.06,26.29 12.06,24.51 12.06,22.99 12.06,21.46 12.06,20.19 12.06,18.41 8.76,27.56 11.3,28.83 11.3,30.23 11.43,31.75 11.81,35.18 13.46,35.94 15.75,36.58 11.94,37.08 16.89,38.1
  pour Bottom (isolate 0.305, no thermals): 13.08,24.51 30.61,24.51 30.61,36.96 27.81,39.75 8.76,39.75 6.73,37.72 6.73,14.1 10.54,14.1 13.08,16.26
  pour Top (isolate 0.305, rank 5, no thermals): 18.41,32.38 18.41,34.92 20.7,34.92 20.7,40.01 20.45,40.26 6.6,40.26 6.73,29.59 5.97,28.83 4.7,28.83 4.7,16.89 13.08,16.89 13.08,32.89 16.64,32.89 16.64,32.38
  pour Top (isolate 0.305, no thermals): 22.48,14.35 23.75,14.35 23.75,24.38 29.59,24.38 29.59,35.43 27.81,35.43 27.81,31.62 18.67,31.62 18.41,31.88 18.41,35.18 18.16,35.43 16.89,35.43 16.76,35.18 16.76,24.38 22.48,24.38
M1VDD  (via drill 0.33 pad 0.25)
  Top 0.305: U2.8 C9.1 44.32,16.26 43.56,17.02 42.29,18.29 35.81,18.29 34.16,19.94 34.16,26.42 34.16,35.56 31.75,37.97 28.7,41.02 v28.7,49.78 | R1.2 v23.11,50.55 | v23.11,50.55 23.11,50.93 | 23.11,50.93 23.11,51.44 | 23.11,51.44 23.11,51.69 21.84,52.96 21.84,58.04 JP6.5 | v23.11,50.55 23.11,50.93 | v23.11,50.55 23.11,51.44
  Bottom 0.305: v28.7,49.78 27.94,50.55 23.88,50.55 23.62,50.55 | 23.62,50.55 v23.11,50.55 23.62,50.55
M1VIN  (via drill 0.33 pad 0.25)
  Top 0.305: U1.12 19.11,31.94 v19.05,31.88 | v8.76,14.1 10.54,11.68 Q1.2
  Bottom 0.305: v19.05,31.88 19.05,32.64 18.54,33.15 8.26,33.15 7.49,32.38 7.49,15.24 v8.76,14.1
  other vias: 12.32,3.94 12.32,5.08 12.32,6.35 12.32,7.62 13.59,8.26 15.11,8.76
  pour Top (isolate 0.305, no thermals): 17.65,1.91 17.65,7.37 13.08,11.94 13.08,16.76 12.95,16.89 8.26,16.89 8.13,16.76 8.13,2.03 8.26,1.91
  pour Bottom (isolate 0.305, no thermals): 17.91,1.78 17.91,9.53 9.53,9.53 9.53,1.78
M2CS
  Top 0.305: JP14.4 64.77,56.77 JP16.2
M2CS2  (via drill 0.33 pad 0.25)
  Top 0.305: U4.7 83.95,13.97 83.19,14.73 83.19,16.51 82.17,17.53 79.76,17.53 77.6,19.68 77.6,35.56 72.01,41.15 v72.01,51.82
  Bottom 0.305: v72.01,51.82 69.22,51.82 JP16.1
M2ENA/B
  Top 0.305: JP14.6 68.96,57.66 R12.2
M2GND  (via drill 0.33 pad 0.25, 0.6 pad 0.25)
  Top 0.305: R18.2 60.49,49.02 C12.2 | 59.69,41.53 C18.- | C13.2 63.88,41.02
  Top 0.406: 48.5,33.53 C14.-